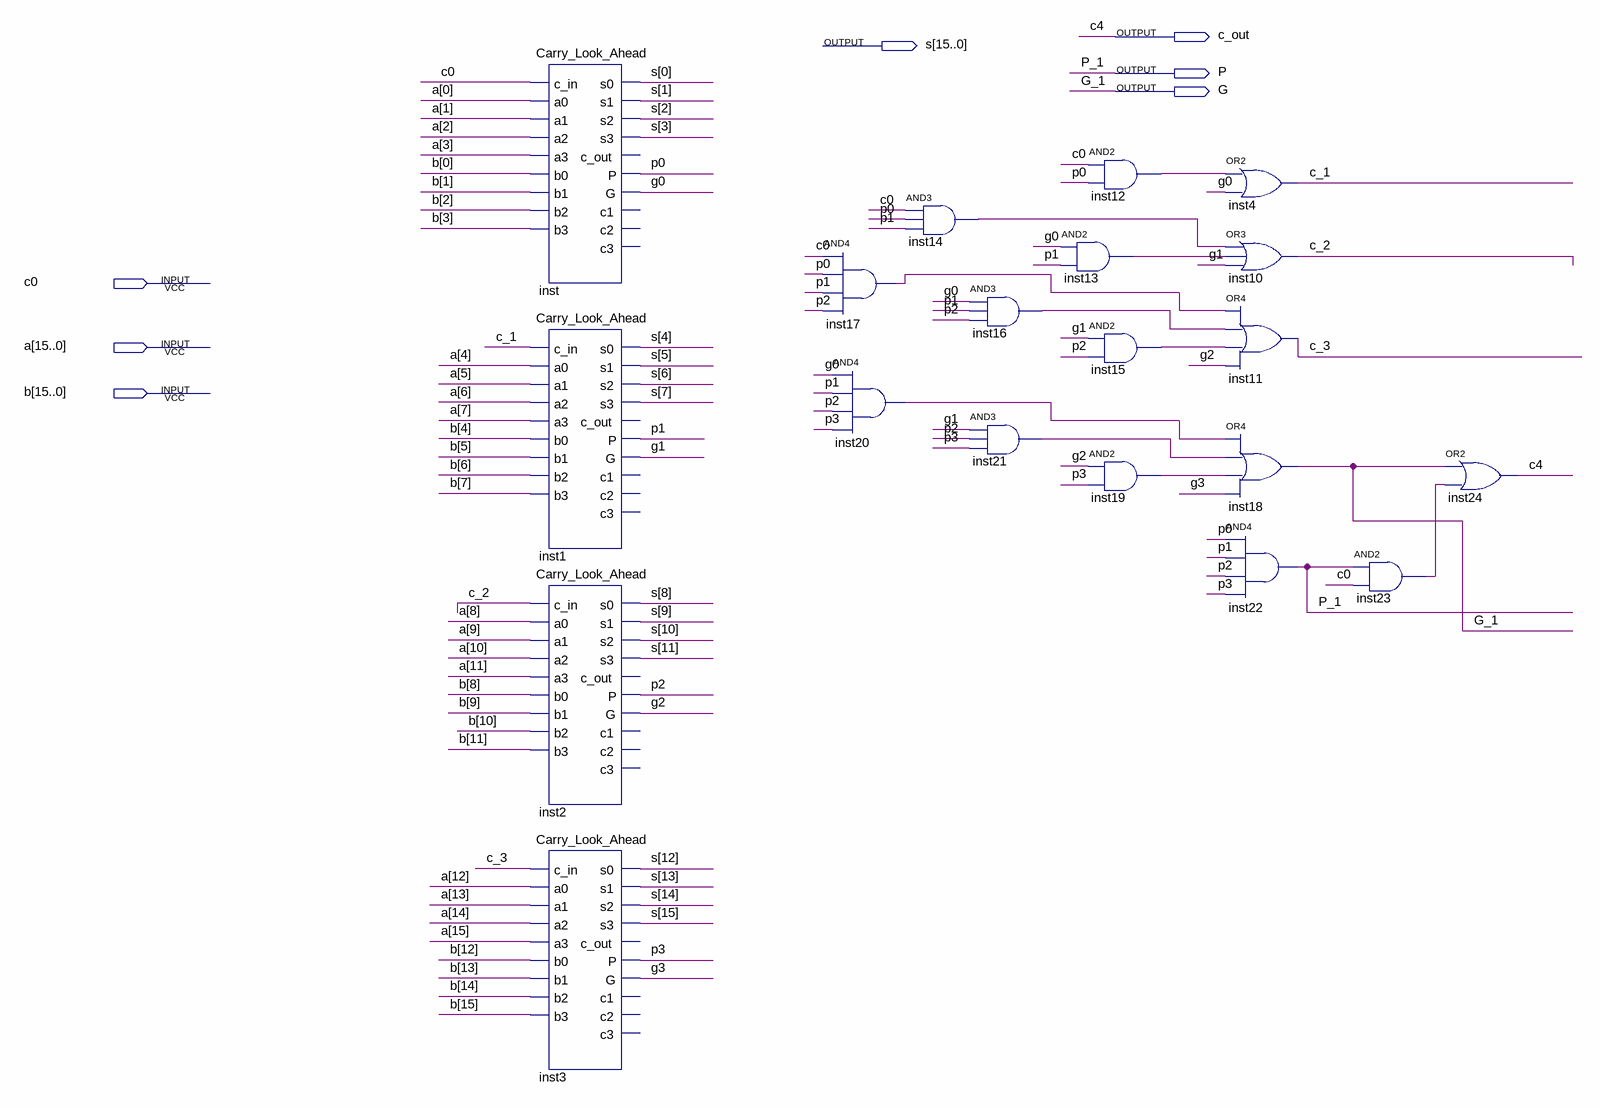
[diagram p0: schematic sheet]
// Quartus schematic cla16bit.bdf as structural Verilog: 20 symbols, 7 pins
module cla16bit (
  input  c0,
  input  [15:0] a,
  input  [15:0] b,
  output c_out,
  output [15:0] s,
  output P,
  output G
);

  wire c_1, c_2, c_3, g0, g1, g2, g3, inst12_out, inst13_out, inst14_out, inst15_out, inst16_out, inst17_out,
       inst19_out, inst20_out, inst21_out, inst23_out, p0, p1, p2, p3;

  Carry_Look_Ahead inst (
    .c_in(c0), .a0(a[0]), .a1(a[1]), .a2(a[2]), .a3(a[3]), .b0(b[0]), .b1(b[1]), .b2(b[2]), .b3(b[3]),
    .s0(s[0]), .s1(s[1]), .s2(s[2]), .s3(s[3]), .P(p0), .G(g0));  // open: c_out, c1, c2, c3
  Carry_Look_Ahead inst1 (
    .c_in(c_1), .a0(a[4]), .a1(a[5]), .a2(a[6]), .a3(a[7]), .b0(b[4]), .b1(b[5]), .b2(b[6]), .b3(b[7]),
    .s0(s[4]), .s1(s[5]), .s2(s[6]), .s3(s[7]), .P(p1), .G(g1));  // open: c_out, c1, c2, c3
  Carry_Look_Ahead inst2 (
    .c_in(c_2), .a0(a[8]), .a1(a[9]), .a2(a[10]), .a3(a[11]), .b0(b[8]), .b1(b[9]), .b2(b[10]), .b3(b[11]),
    .s0(s[8]), .s1(s[9]), .s2(s[10]), .s3(s[11]), .P(p2), .G(g2));  // open: c_out, c1, c2, c3
  Carry_Look_Ahead inst3 (
    .c_in(c_3), .a0(a[12]), .a1(a[13]), .a2(a[14]), .a3(a[15]), .b0(b[12]), .b1(b[13]), .b2(b[14]),
    .b3(b[15]), .s0(s[12]), .s1(s[13]), .s2(s[14]), .s3(s[15]), .P(p3), .G(g3));  // open: c_out, c1, c2, c3
  and inst17 (inst17_out, c0, p0, p1, p2);
  and inst20 (inst20_out, g0, p1, p2, p3);
  and inst14 (inst14_out, c0, p0, p1);
  and inst16 (inst16_out, g0, p1, p2);
  and inst21 (inst21_out, g1, p2, p3);
  and inst13 (inst13_out, g0, p1);
  and inst12 (inst12_out, c0, p0);
  and inst15 (inst15_out, g1, p2);
  and inst19 (inst19_out, g2, p3);
  or inst4 (c_1, inst12_out, g0);
  or inst10 (c_2, inst14_out, inst13_out, g1);
  or inst11 (c_3, inst17_out, inst16_out, inst15_out, g2);
  or inst18 (G, inst20_out, inst21_out, inst19_out, g3);
  and inst22 (P, p0, p1, p2, p3);
  and inst23 (inst23_out, P, c0);
  or inst24 (c_out, G, inst23_out);

  // Other names for the same wires on the sheet: c4 = c_out; G_1 = G; P_1 = P
endmodule
